# Altium project AudioAmp.PrjPcb
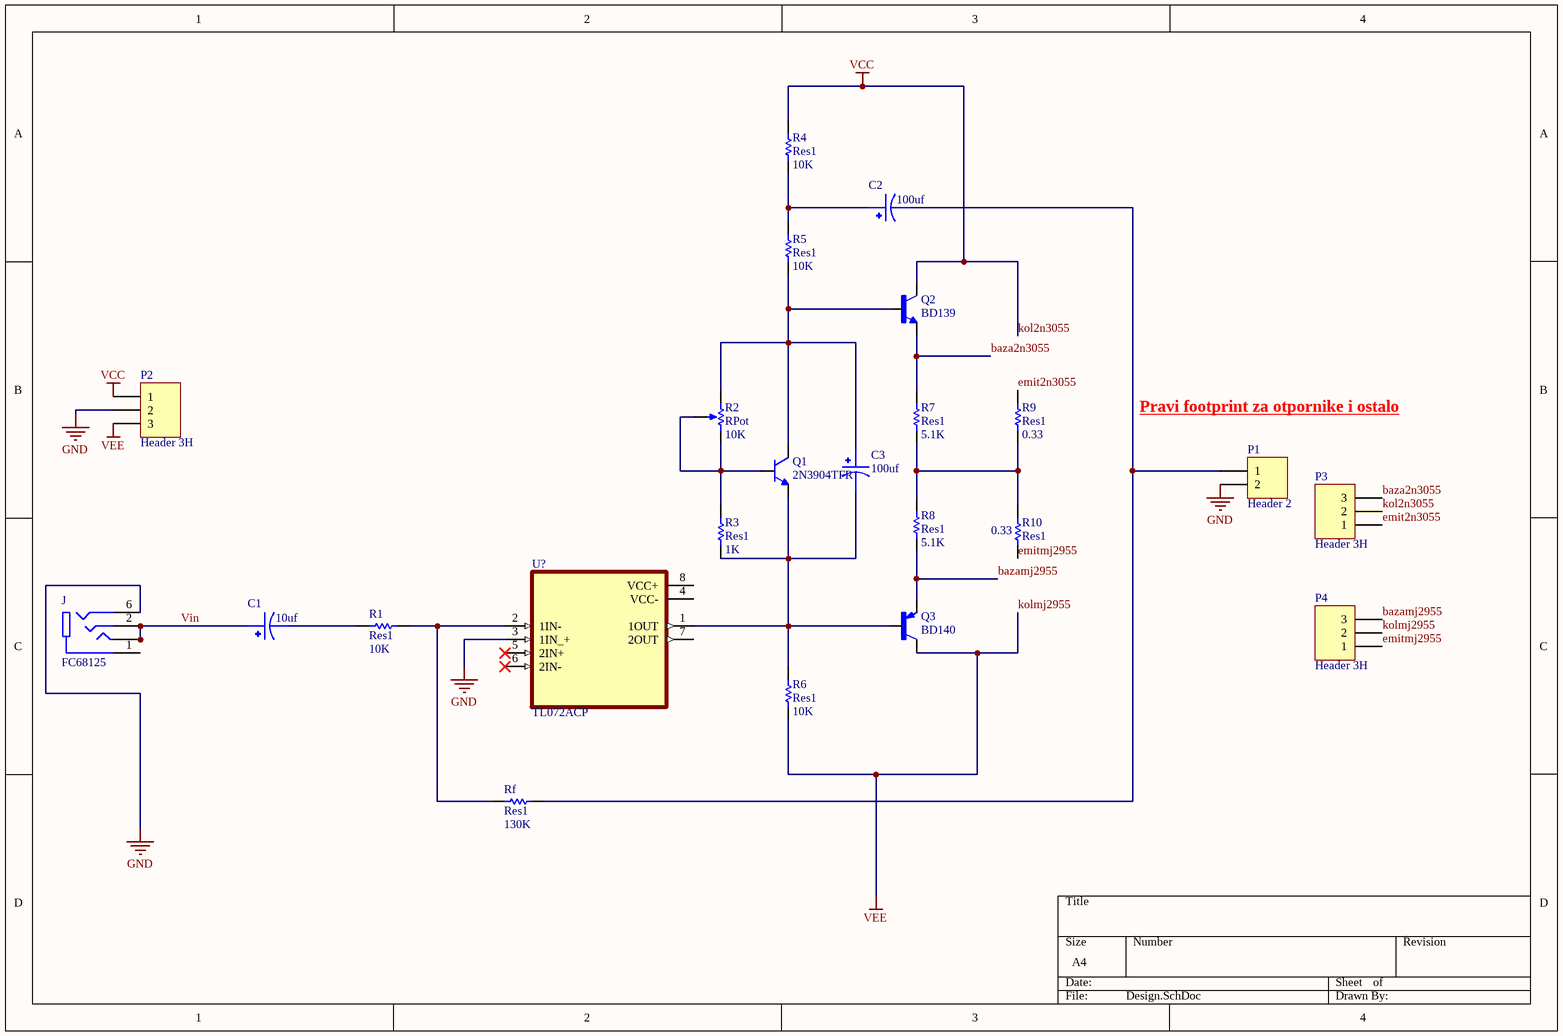
[diagram p0: Design.SchDoc]
1 sheet, 23 parts. Net scope: global (net labels, ports and power ports of the same name join across sheets).
Board file: audpc.PcbDoc

## Sheet Design.SchDoc
size A4

### Parts
C1  value 10uf  [CAPPRD350W60D850H1250]  (hidden comment: ECA1HM101)
C2  value 100uf  [CAPPRD350W60D850H1250]  (hidden comment: ECA1HM101)
C3  value 100uf  [CAPPRD350W60D850H1250]  (hidden comment: ECA1HM101)
J  FC68125  [CLIFF_FC68125]
P1  Header 2  [HDR1X2]
P2  Header 3H  [HDR1X3H]
P3  Header 3H  [HDR1X3H]
P4  Header 3H  [HDR1X3H]
Q1  2N3904TFR  [TO92254P520H877-3]
Q2  BD139  [TO126]
Q3  BD140  [TO245P780X300X1364-3]
R1  Res1  value 10K  [AXIAL-0.3]
R2  RPot  value 10K  [VR5]
R3  Res1  value 1K  [AXIAL-0.3]
R4  Res1  value 10K  [AXIAL-0.3]
R5  Res1  value 10K  [AXIAL-0.3]
R6  Res1  value 10K  [AXIAL-0.3]
R7  Res1  value 5.1K  [AXIAL-0.3]
R8  Res1  value 5.1K  [AXIAL-0.3]
R9  Res1  value 0.33  [RESAR5460W80L4950T1100H100]
R10  Res1  value 0.33  [RESAR5460W80L4950T1100H100]
Rf  Res1  value 130K  [AXIAL-0.3]
U?  TL072ACP  [DIP794W45P254L959H508Q8]

### Nets
GND: J.6(6SR) P1.2 P2.2 U?.3(1IN_+)
kol2n3055: P2.1 P3.2 Q2.2(C) R4.1  [also labelled VCC]
kolmj2955: P2.3 P4.2 Q3.2(C) R6.2  [also labelled VEE]
baza2n3055: P3.3 Q2.1(E) R7.1
bazamj2955: P4.3 Q3.1(E) R8.2
emit2n3055: P3.1 R9.1
emitmj2955: P4.1 R10.2
Vin: C1.1 J.2(2R) J.3.1(3T) J.3.2(3T)
NetC1_2: C1.2 R1.2
NetC2_1: C2.1 R4.2 R5.1
NetC2_2: C2.2 P1.1 Rf.1
NetC3_1: C3.1 Q1.3(C) Q2.3(B) R2.1(TOP) R5.2
NetC3_2: C3.2 Q1.1(E) Q3.3(B) R3.1 R6.1 U?.1(1OUT)
NetQ1_2: Q1.2(B) R2.2(BOT) R2.3(TAP) R3.2
NetR1_1: R1.1 Rf.2 U?.2(1IN-)
NetR7_2: R7.2 R8.1 R9.2 R10.1

Not connected (* = marked no-connect by the designer): J 1(1S); U? 4(VCC-) 5(2IN+)* 6(2IN-)* 7(2OUT) 8(VCC+)

### Notes on the sheet
- Pravi footprint za otpornike i ostalo

### Library data of the parts
C1-C3 = ECA1HM101: 100ÂµF 50V Aluminum Electrolytic Capacitors Radial, Can 2000 Hrs @ 85Â°C; MF: Panasonic; Price: None; SnapEDA_Link: https://www.snapeda.com/parts/ECA1HM101/Panasonic/view-part/4478734/?ref=snap; Availability: Unavailable; MP: ECA1HM101; Package: Radial Panasonic
J = FC68125: 3.5mm 4 Pole Jack Sockets; MF: Cliff Electronics; Package: Package Analog Devices; Availability: Unavailable; MP: FC68125; Value: *; SnapEDA_Link: https://www.snapeda.com/parts/FC68125/Cliff%20Electronics/view-part/3594489/?ref=snap; Price: None
P1 = Header 2: Header, 2-Pin; LatestRevisionDate: 17-Jul-2002; LatestRevisionNote: Re-released for DXP Platform.; Publisher: Altium Limited
P2-P4 = Header 3H: Header, 3-Pin, Right Angle; LatestRevisionDate: 17-Jul-2002; LatestRevisionNote: Re-released for DXP Platform.; Publisher: Altium Limited
Q1 = 2N3904TFR: Bipolar _BJT_ Transistor NPN 40V 200mA 300MHz 625mW Through Hole TO-92-3; MF: ON Semiconductor; Price: None; Availability: Unavailable; Package: TO-92 Fairchild Semiconductor; SnapEDA_Link: https://www.snapeda.com/parts/2N3904TFR/ON%20Semiconductor/view-part/272935/?ref=snap; MP: 2N3904TFR; Value: *
Q2 = BD139: Bipolar (BJT) Transistor NPN 80V 1.5A 1.25W Through Hole TO-126-3; MF: ON Semiconductor; Digi-Key_Part_Number: BD13916S-ND; Check_prices: https://www.snapeda.com/parts/BD139/ON%20Semiconductor/view-part/2781881/?ref=eda; MP: BD139; Value: *; SnapEDA_Link: https://www.snapeda.com/parts/BD139/ON%20Semiconductor/view-part/2781881/?ref=snap; Package: TO-225-3 ON Semiconductor
Q3 = BD140: Bipolar _BJT_ Transistor PNP 80V 1.5A 1.25W Through Hole SOT-32-3; MF: STMicroelectronics; SnapEDA_Link: https://www.snapeda.com/parts/BD140/STMicroelectronics/view-part/4503197/?ref=snap; Value: *; MP: BD140; Package: TO-126 STMicroelectronics; Price: None; Availability: Unavailable
R1 R3-R10 Rf = Res1: Resistor; Published: 8-Jun-2000; LatestRevisionDate: 17-Jul-2002; LatestRevisionNote: Re-released for DXP Platform.; PackageReference: AXIAL-0.3; Publisher: Altium Limited; PackageDescription: Axial Device, Thru-Hole; 2 Leads; 0.3 in Pin Spacing
R2 = RPot: Potentiometer; Sim Note: Enter the Resistance value and the set point into parameter fields.; Set Position: 0.5; Published: 8-Jun-2000; LatestRevisionDate: 17-Jul-2002; LatestRevisionNote: Re-released for DXP Platform.; PackageReference: VR5; Publisher: Altium Limited; PackageDescription: Variable Resistor, Thru-Hole; 3 Leads
U? = TL072ACP: Dual low-noise JFET-input improved offset operational amplifier 8-PDIP 0 to 70; MF: Texas Instruments; Texas_Instruments-Purchase-URL: https://snapeda.com/shop?store=Texas+Instruments&id=231831; Package: PDIP-8 Texas; DigiKey-Purchase-URL: https://snapeda.com/shop?store=DigiKey&id=231831; Mouser-Purchase-URL: https://snapeda.com/shop?store=Mouser&id=231831; MP: TL072ACP; Value: *; Availability: Good; Price: None; SnapEDA_Link: https://www.snapeda.com/parts/TL072ACP/Texas%20Instruments/view-part/231831/?ref=snap